# EAGLE design ncv3020a-5v (EAGLE 7.3.0)
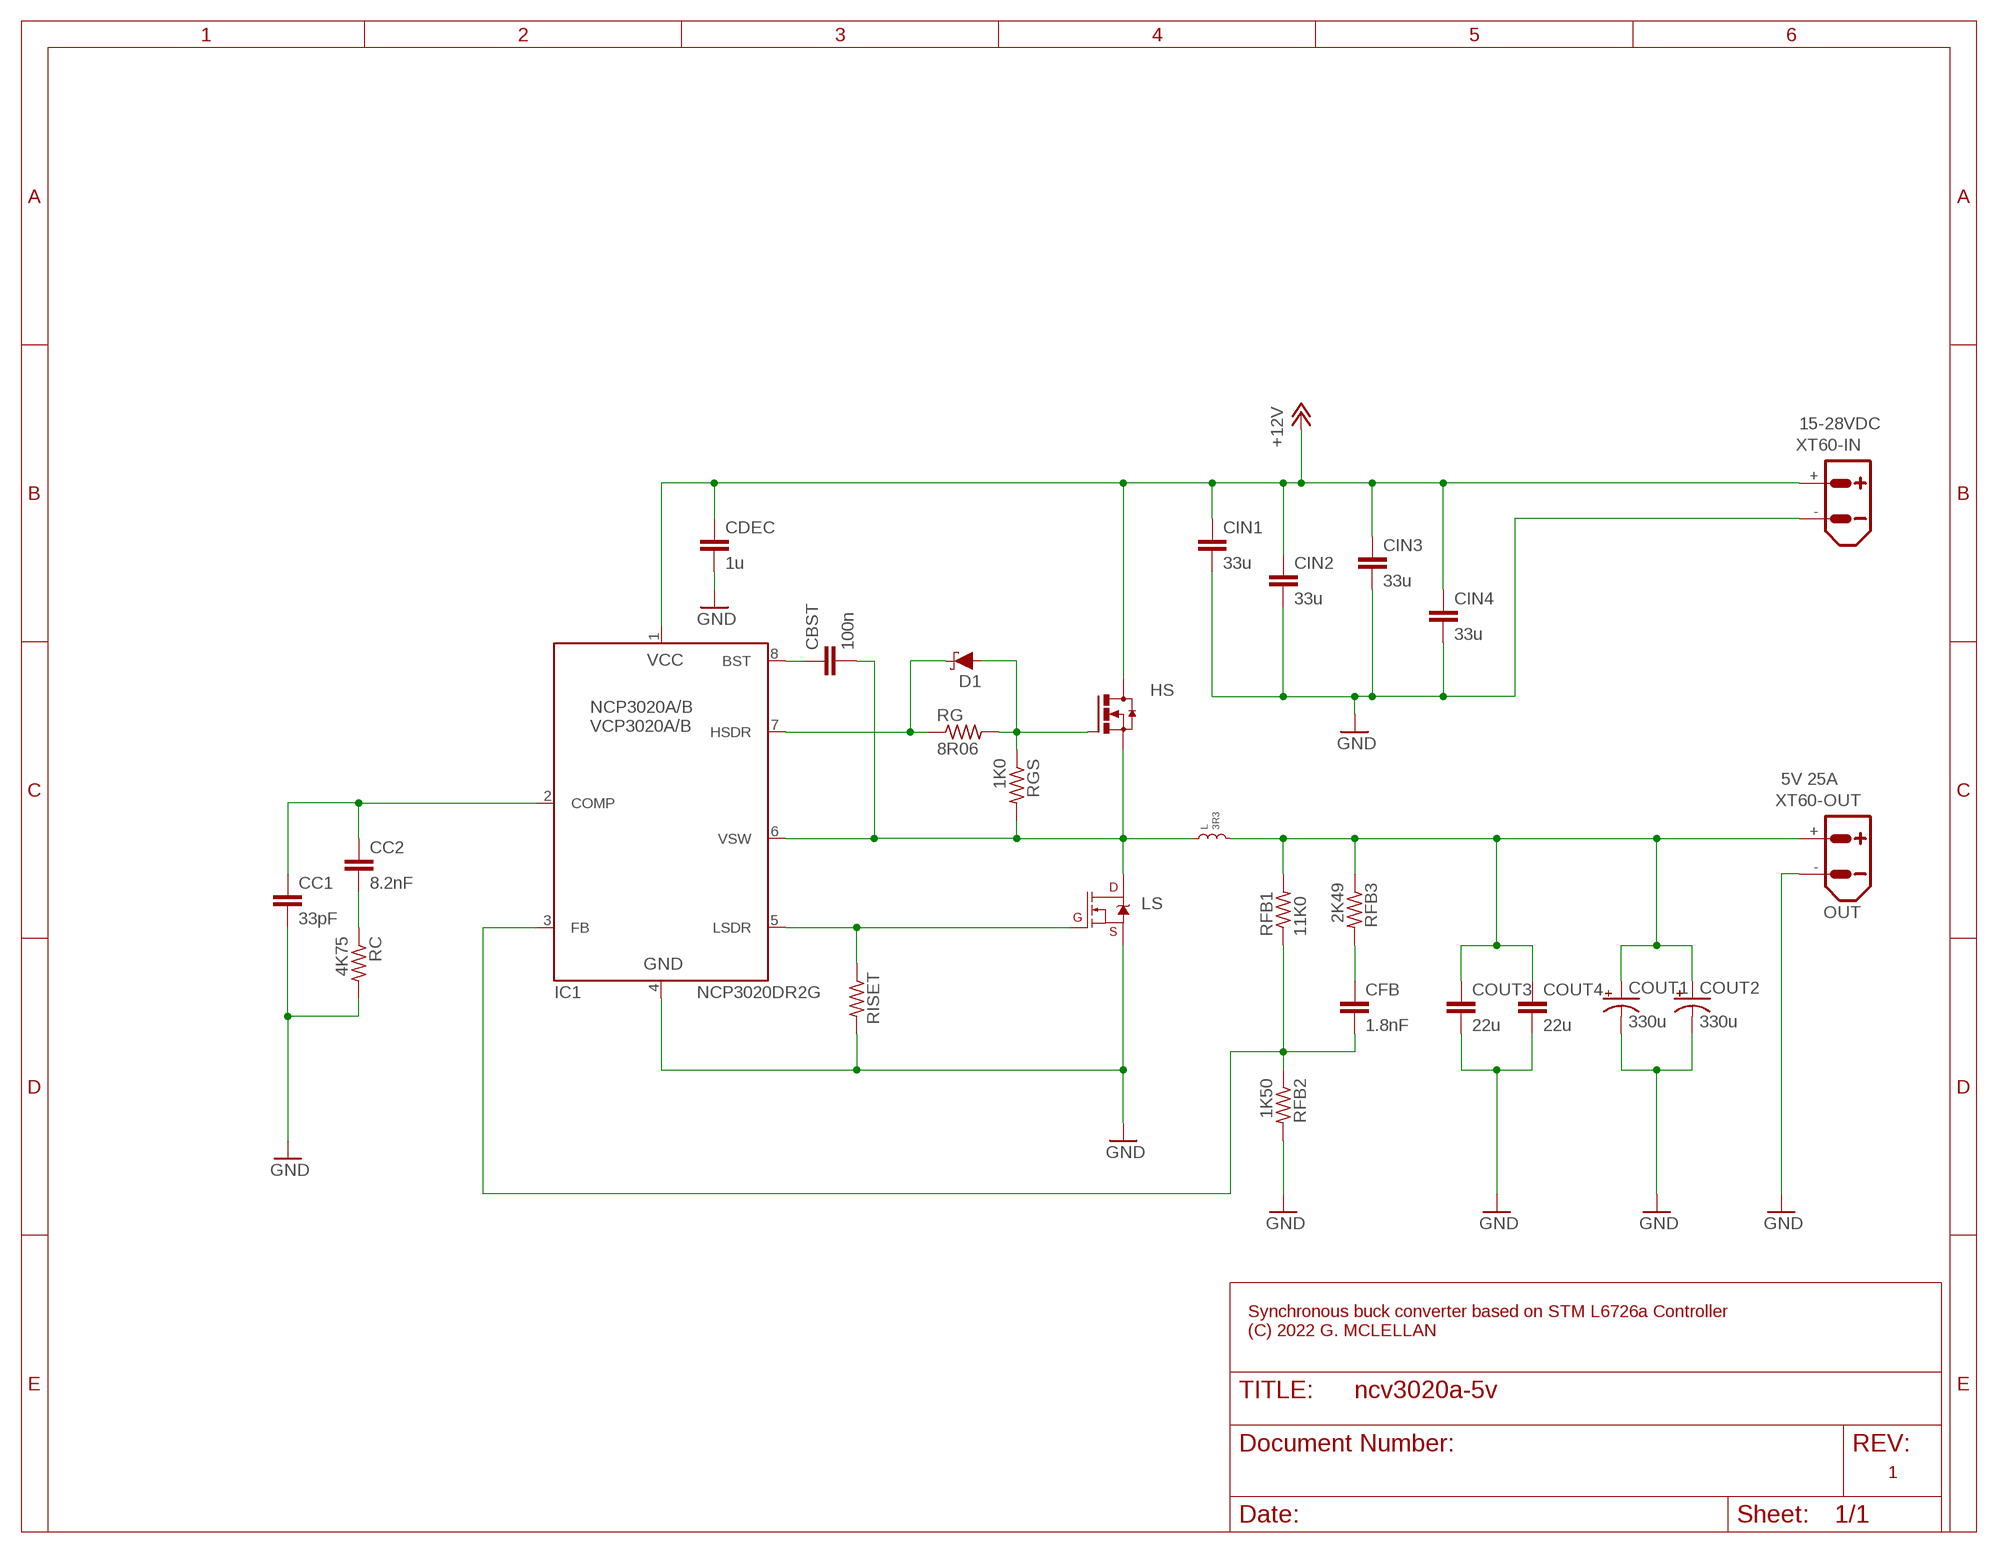
[diagram p0: schematic, sheet 1]

## Parts
CBST  100n  C-EUC0603  [C0603]
CC1  33pF  C-EUC0603  [C0603]
CC2  8.2nF  C-EUC0603  [C0603]
CDEC  1u  C-EUC1206  [C1206]
CFB  1.8nF  C-EUC0603  [C0603]
CIN1  33u  C-EUC2220K  [C2220K]
CIN2  33u  C-EUC2220K  [C2220K]
CIN3  33u  C-EUC2220K  [C2220K]
CIN4  33u  C-EUC2220K  [C2220K]
COUT1  330u  CPOL-USSANYO_SMD_C6  [SANYO-OSCON_SMD_C6]
COUT2  330u  CPOL-USSANYO_SMD_C6  [SANYO-OSCON_SMD_C6]
COUT3  22u  C-EUC1206  [C1206]
COUT4  22u  C-EUC1206  [C1206]
D1  DIODE-SCHOTTKY-BAT20J  [SOD-323]
HS  N_MOSFET_POWERSO8  [POWERSO8]
IC1  NCP3020DR2G  [SO-08]
L  3R3  INDUCTOR.XAL1010  [XAL1010]
LS  MOSFET-NCH-FDS6630A  [SO08]
RC  4K75  R-US_R0603  [R0603]
RFB1  11K0  R-US_R0805  [R0805]
RFB2  1K50  R-US_R0805  [R0805]
RFB3  2K49  R-US_R0805  [R0805]
RG  8R06  R-US_R0603  [R0603]
RGS  1K0  R-US_R0603  [R0603]
RISET  R-US_R0603  [R0603]
XT60-IN  XT60PW-M  [XT60PW-M]
XT60-OUT  OUT  XT60PW-M  [XT60PW-M]

## Nets
CC1: CC2.2 RC.1
COMP: CC1.1 CC2.1 IC1.2(COMP)
FB: CFB.2 IC1.3(FB) RFB1.1 RFB2.1
GND: CC1.2 CDEC.2 CIN1.2 CIN2.2 CIN3.2 CIN4.2 COUT1.- COUT2.- COUT3.2 COUT4.2 IC1.4(GND) LS.1(S) LS.2(S) LS.3(S) RC.2 RFB2.2 RISET.2 XT60-IN.- XT60-OUT.-
HSDR: D1.A HS.4(G) RG.2 RGS.1
HSDR`: D1.C IC1.7(HSDR) RG.1
LSDR: IC1.5(LSDR) LS.4(G) RISET.1
N$1: CBST.1 IC1.8(BST)
N$4: CFB.1 RFB3.2
VCC: CDEC.1 CIN1.1 CIN2.1 CIN3.1 CIN4.1 HS.5(D) HS.6(D) HS.7(D) HS.8(D) HS.PAD(D) IC1.1(VCC) XT60-IN.+ ; supply symbol labelled +12V
VOUT: COUT1.+ COUT2.+ COUT3.1 COUT4.1 L.P$2 RFB1.2 RFB3.1 XT60-OUT.+
VSW: CBST.2 HS.1(S) HS.2(S) HS.3(S) IC1.6(VSW) L.P$1 LS.5(D) LS.6(D) LS.7(D) LS.8(D) RGS.2

## Notes on the sheet
- 15-28VDC
- 5V 25A
- Synchronous buck converter based on STM L6726a Controller
  (C) 2022 G. MCLELLAN
- 1

## Library data of the parts
CBST CC1 CC2 CDEC CFB CIN1-CIN4 COUT3 COUT4 = rcl:C-EU: CAPACITOR, European symbol
COUT1 COUT2 = rcl:CPOL-US: POLARIZED CAPACITOR, American symbol
D1 = SparkFun-DiscreteSemi:DIODE-SCHOTTKY: Schottky diode A Schottky diode is a semiconductor diode which has a low forward voltage drop and a very fast switching action.; PROD_ID: DIO-11623; VALUE: 1A/23V/620mV
HS = power-mosfet:N_MOSFET_POWERSO8
IC1 = onsemi-ncp3020a:NCP3020: The NCP3020 is a PWM device designed to operate from a wide input range and is capable of producing an output voltage as low as 0.6 V. The NCP3020 provides integrated gate drivers and an internally set 300 kHz (NCP3020A) or 600 kHz (NCP3020B) oscillator. The NCP3020 also has an externally compensated transconductance error amplifier with an internally fixed soft−start. Protection features include lossless current limit and short circuit protection, output overvoltage protection, output undervoltage protection, and input undervoltage lockout.
L = coilcraft:INDUCTOR
LS = SparkFun-DiscreteSemi:MOSFET-NCH: N-channel MOSFETs Voltage controlled devices that allow control of high current outputs. SparkFun Products: SparkFun OpenScale <https://www.sparkfun.com/products/13261> SparkFun Digital Sandbox <https://www.sparkfun.com/products/12651> SparkFun Monster Moto Shield <https://www.sparkfun.com/products/10182> SparkFun MOSFET Power Controller <https://www.sparkfun.com/products/11214>; PROD_ID: TRANS-08089; VALUE: 6.5A/30V/38mΩ
RC RFB1-RFB3 RG RGS RISET = rcl:R-US_: RESISTOR, American symbol
XT60-IN XT60-OUT = amass:XT60: AMASS XT60 connector Store in Japan AMASS XT60 connector <https://szc.jp/ams-xt60>

## Board
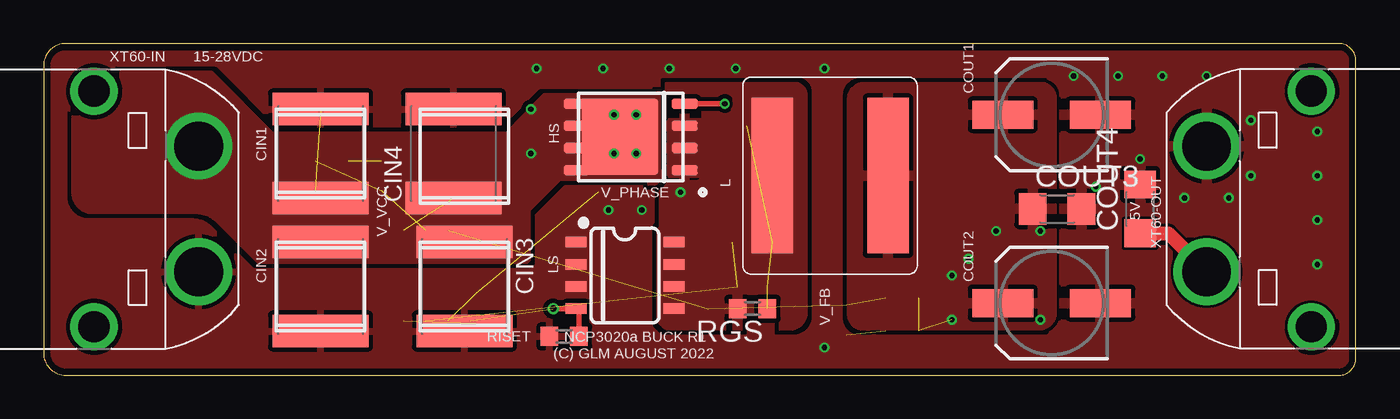
[diagram p1: board, top side]
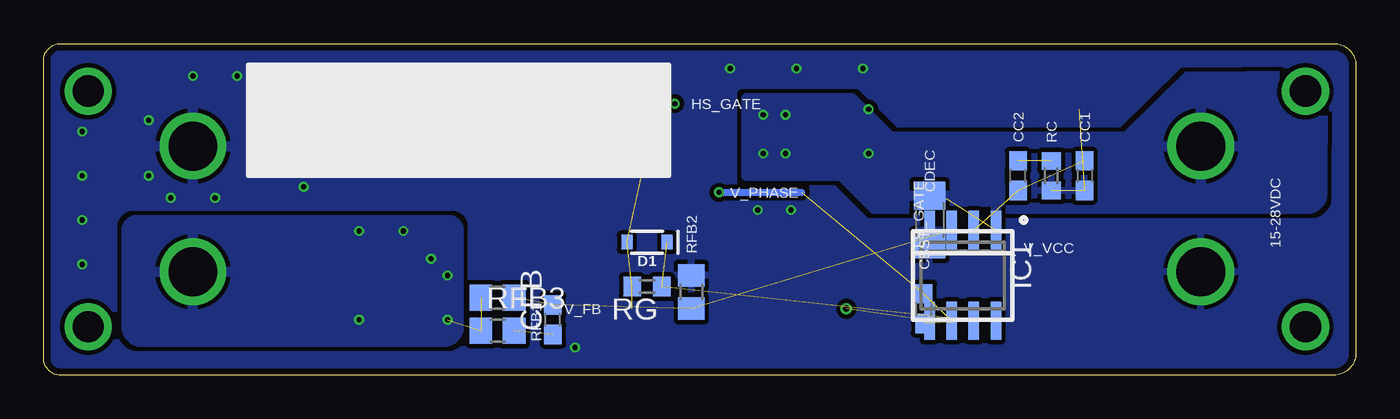
[diagram p2: board, bottom side, seen from below]

Size 75.23 x 19 mm. Coordinates in mm from the lower left corner, seen from the top.
Outline: 0,17.73 0,1.27 arc90 1.27,0 74.27,0 arc90 75.23,0.96 75.23,18.03 arc90 74.27,19 1.27,19 arc90 0,17.73
Copper layers (1*16): Top 0.035559375mm / dielectric 1.6mm / Bottom 0.035559375mm
Design rules "oshpark-2layer": minimum track width 6mil, minimum drill 10mil, track to track 6mil, track to pad 6mil, pad to pad 6mil, via to via 6mil, smd to smd 6mil, copper to edge 15mil, drill to drill 6mil, minimum pad ring 5mil, minimum via ring 5mil, stop-mask expansion 2.5mil, vias tented up to drill 0mil, thermal gap 10mil

### Footprints (pad centres in the part's own frame; a part is rotated, then mirrored left to right if it is on the bottom)
C0603 = smd 1.1 x 1: 1 -0.85,0; 2 0.85,0
C1206 = smd 1.6 x 1.8: 1 -1.4,0; 2 1.4,0
C2220K = smd 1.85 x 5.5: 1 -2.55,0; 2 2.55,0
SANYO-OSCON_SMD_C6 = smd 3.5 x 1.6: + 2.8,0; - -2.8,0
SOD-323 = smd 0.63 x 0.83: A 1.15,0; C -1.15,0
POWERSO8 = smd 1.5 x 0.6: 1 -3.1,1.905; 2 -3.1,0.635; 3 -3.1,-0.635; 4 -3.1,-1.905; 5 3.1,-1.905; 6 3.1,-0.635; 7 3.1,0.635; 8 3.1,1.905 | smd 4.4 x 4.4: PAD 0.6,0
SO-08 = smd 0.6 x 2.2: 1 -1.905,-2.6; 2 -0.635,-2.6; 3 0.635,-2.6; 4 1.905,-2.6; 5 1.905,2.6; 6 0.635,2.6; 7 -0.635,2.6; 8 -1.905,2.6
XAL1010 = smd 2.38 x 8.91: P$1 -3.325,0; P$2 3.325,0
SO08 = smd 0.6 x 1.2: 1 -1.905,-2.8; 2 -0.635,-2.8; 3 0.635,-2.8; 4 1.905,-2.8; 5 1.905,2.8; 6 0.635,2.8; 7 -0.635,2.8; 8 -1.905,2.8
R0603 = smd 1 x 1.1: 1 -0.85,0; 2 0.85,0
R0805 = smd 1.3 x 1.5: 1 -0.95,0; 2 0.95,0
XT60PW-M = drill 2.8: + 3.6,0; - -3.6,0 | drill 1.8: P$3 -6.75,6; P$4 6.75,6

### Placement (x,y rotation side)
CBST  24.76,3.81 90 bottom
CC1  15.56,11.43 270 bottom
CC2  19.37,11.43 90 bottom
CDEC  24.45,8.89 270 bottom
CFB  46.04,3.17 90 bottom
CIN1  15.88,12.7 90 top
CIN2  15.88,5.08 270 top
CIN3  24.13,5.08 270 top
CIN4  23.5,12.7 90 top
COUT1  57.78,14.92 180 top
COUT2  57.78,4.13 180 top
COUT3  58.1,9.53 0 top
COUT4  62.87,9.53 90 top
D1  40.64,7.62 180 bottom
HS  33.66,13.65 180 top
IC1  22.54,5.71 180 bottom
L  45.08,11.43 0 top
LS  33.34,5.71 270 top
RC  17.46,11.43 270 bottom
RFB1  49.21,4.45 180 bottom
RFB2  38.1,4.76 90 bottom
RFB3  49.21,2.54 0 bottom
RG  40.64,5.08 180 bottom
RGS  40.64,3.81 180 top
RISET  29.85,2.22 180 top
XT60-IN  8.89,9.53 90 top
XT60-OUT  66.67,9.53 270 top

### Tracks (layer width: path | path; a pad name or v marks a point on that pad's centre or on a via)
CC1  (1 unrouted)
COMP  (2 unrouted)
FB  (3 unrouted)
GND  (via drill 0.3)  (2 unrouted)
  other vias: 59.06,17.14 60.33,10.79 62.87,12.38 61.59,17.14 32.39,9.46 28.26,17.58 32.07,17.58 35.88,17.58 39.69,17.58 44.77,17.58 34.29,9.46 64.14,17.14 66.67,17.14 65.41,10.16 67.95,10.16 69.22,11.43 73.03,11.43 73.03,13.97 69.22,14.61 73.03,8.89 73.03,6.35 44.77,1.59
  pour Top (rank 5): 57.78,2.69 57.78,17.14 arc-90 58.42,17.78 73.66,17.78 arc-90 74.3,17.14 74.3,1.91 arc-90 73.66,1.27 59.2,1.27 arc-90
  pour Bottom (rank 5): 51.44,10.16 51.44,17.14 arc-90 52.07,17.78 69.85,17.78 arc-90 70.48,17.14 70.48,10.16
  pour Bottom (isolate 0.254, rank 6): 0,19.05 75.56,19.05 75.56,0 0,0
  pour Top (isolate 0.254, rank 6): 0,19.05 75.56,19.05 75.56,0 0,0
  pour Top (isolate 0.254, rank 5, no thermals): 29.21,4.45 32.07,4.45 32.07,8.57 29.21,8.57
HSDR  (via drill 0.3)  (3 unrouted)
  Top 0.305: HS.4 v39.05,15.56
  Bottom 0.254: 40.32,14.29 arc90 v39.05,15.56
HSDR`  (2 unrouted)
LSDR  (via drill 0.38)  (1 unrouted)
  Top 0.305: v29.22,3.81 LS.4 30.69,3.81 RISET.1
N$1  (1 unrouted)
N$4  (1 unrouted)
VCC  (via drill 0.3)  (1 unrouted)
  other vias: 33.97,14.92 33.97,12.7 32.7,14.92 32.7,12.7 27.94,15.24 27.94,12.7
  pour Top (isolate 0.254, rank 4, no thermals): 8.78,9.53 2.8,9.53 arc-90 1.9,10.42 1.9,16.25 arc-90 2.8,17.14 9.55,17.14 13.02,13.67 26.65,13.7 28.78,15.88 34.92,15.88 34.92,11.43 29.53,11.43 27.62,9.53 27.62,6.67 12.39,6.66 10.05,9 arc45
  pour Bottom (isolate 0.254, rank 4): 9.57,9.53 2.81,9.53 arc-90 1.93,10.4 1.91,16.24 arc-90 2.81,17.14 9.67,17.09 13.15,13.65 26.67,13.65 28.89,15.88 34.92,15.88 34.92,11.43 29.53,11.43 27.62,9.53 13.97,9.53 13.08,9.51
  pour Top (isolate 0.254, rank 2, no thermals): 34.78,11.12 35.24,11.57 arc-91
  pour Top (isolate 0.254, rank 2, no thermals): 34.79,11.11 arc90 35.24,11.56 35.24,16.19
VOUT  (via drill 0.3)  (2 unrouted)
  Top 0.813: COUT4.1 64.48,8.12 XT60-OUT.+
  other vias: 57.15,3.17 52.07,3.17 53.02,6.67 54.61,8.26 57.15,8.26 52.07,5.71
  pour Top (rank 4): 57.08,2.86 46.99,2.86 arc-90 46.36,3.49 46.36,15.8 arc-90 47.06,16.51 57.15,16.51 arc-90 57.78,15.88 57.78,3.57 arc-90
  pour Bottom (rank 4): 70.48,8.26 70.48,2.8 arc-90 69.59,1.91 52.33,1.91 arc-90 51.44,2.8 51.44,8.26 arc-90 52.07,8.89 69.85,8.89 arc-90
VSW  (via drill 0.3)  (2 unrouted)
  Bottom 0.406: v36.51,10.48 31.78,10.48
  pour Top (isolate 0.254, rank 4): 35.56,3.17 35.56,16.19 arc-90 35.88,16.51 43.05,16.51 arc-90 43.5,16.06 43.5,3.57 arc-90 42.79,2.86 35.88,2.86 arc-90
  pour Top (isolate 0.254, rank 5, no thermals): 37.78,14.61 35.88,14.61 35.88,11.43 37.78,11.43
  pour Top (isolate 0.254, rank 4, no thermals): 37.78,2.86 37.78,8.12 arc90 37.33,8.57 35.69,8.57 arc90 35.24,8.12 35.24,3.31 arc90 35.69,2.86
  pour Top (rank 2, no thermals): 40,16.19 43.18,16.19 arc-90 43.5,15.88 43.5,7.3 arc-90 42.86,6.67 40.32,6.67 arc-90 39.69,7.3 39.69,15.88 arc-90

### Text on the board
tNames: 15-28VDC | V_PHASE | 5V | V_VCC | V_FB | NCP3020a BUCK R1 | (C) GLM AUGUST 2022
bNames: HS_GATE | V_PHASE | 15-28VDC | V_VCC | LS_GATE | V_FB